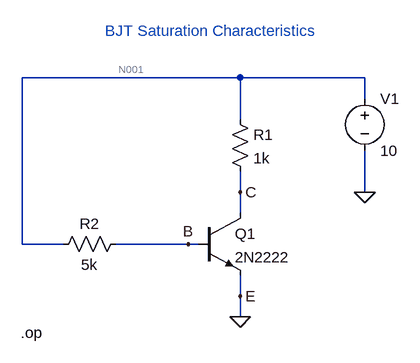
[diagram p0: schematic 10 BJT Saturation Characteristics.asc]
10 BJT Saturation Characteristics.asc, the LTspice schematic file:
Version 4
SHEET 1 880 680
WIRE 288 -80 -48 -80
WIRE 480 -80 288 -80
WIRE 480 -48 480 -80
WIRE 288 -16 288 -80
WIRE 288 96 288 64
WIRE 480 96 480 32
WIRE 288 128 288 96
WIRE -48 176 -48 -80
WIRE 16 176 -48 176
WIRE 208 176 96 176
WIRE 224 176 208 176
WIRE 288 256 288 224
WIRE 288 288 288 256
FLAG 288 288 0
FLAG 480 96 0
FLAG 208 176 B
FLAG 288 256 E
FLAG 288 96 C
SYMBOL npn 224 128 R0
SYMATTR InstName Q1
SYMATTR Value 2N2222
SYMBOL res 272 -32 R0
SYMATTR InstName R1
SYMATTR Value 1k
SYMBOL res 112 160 R90
WINDOW 0 0 56 VBottom 2
WINDOW 3 32 56 VTop 2
SYMATTR InstName R2
SYMATTR Value 5k
SYMBOL voltage 480 -64 R0
WINDOW 123 0 0 Left 0
WINDOW 39 0 0 Left 0
SYMATTR InstName V1
SYMATTR Value 10
TEXT 80 -152 Left 2 ;BJT Saturation Characteristics
TEXT -50 312 Left 2 !.op

The netlist it stands for:
* 10 BJT Saturation Characteristics.asc
Q1 C B 0 0 2N2222
R1 N001 C 1k
R2 B N001 5k
V1 N001 0 10
.model NPN NPN
.model PNP PNP
.lib standard.bjt
* BJT Saturation Characteristics
.op
.backanno
.end

* Results of the author's LTspice run, read from the files saved beside the schematic
* Operating Point:
*   V(c) = 36.7 mV
*   V(b) = 750.4 mV
*   V(n001) = 10 V
*   Ic(Q1) = 9.963 mA
*   Ib(Q1) = 1.85 mA
*   Ie(Q1) = -11.81 mA
*   I(R2) = -1.85 mA
*   I(R1) = 9.963 mA
*   I(V1) = -11.81 mA
* From the log:
*   Semiconductor Device Operating Points:
*                           --- Bipolar Transistors ---
*   Name:       q1
*   Model:    2n2222
*   Ib:       1.85e-03
*   Ic:       9.96e-03
*   Vbe:      7.50e-01
*   Vbc:      7.14e-01
*   Vce:      3.67e-02
*   BetaDC:   5.39e+00
*   Gm:       4.30e-01
*   Rpi:      2.91e+02
*   Rx:       1.00e+01
*   Ro:       5.20e+00
*   Cbe:      2.87e-10
*   Cbc:      2.04e-08
*   Cjs:      0.00e+00
*   BetaAC:   1.25e+02
*   Cbx:      0.00e+00
*   Ft:       3.30e+06